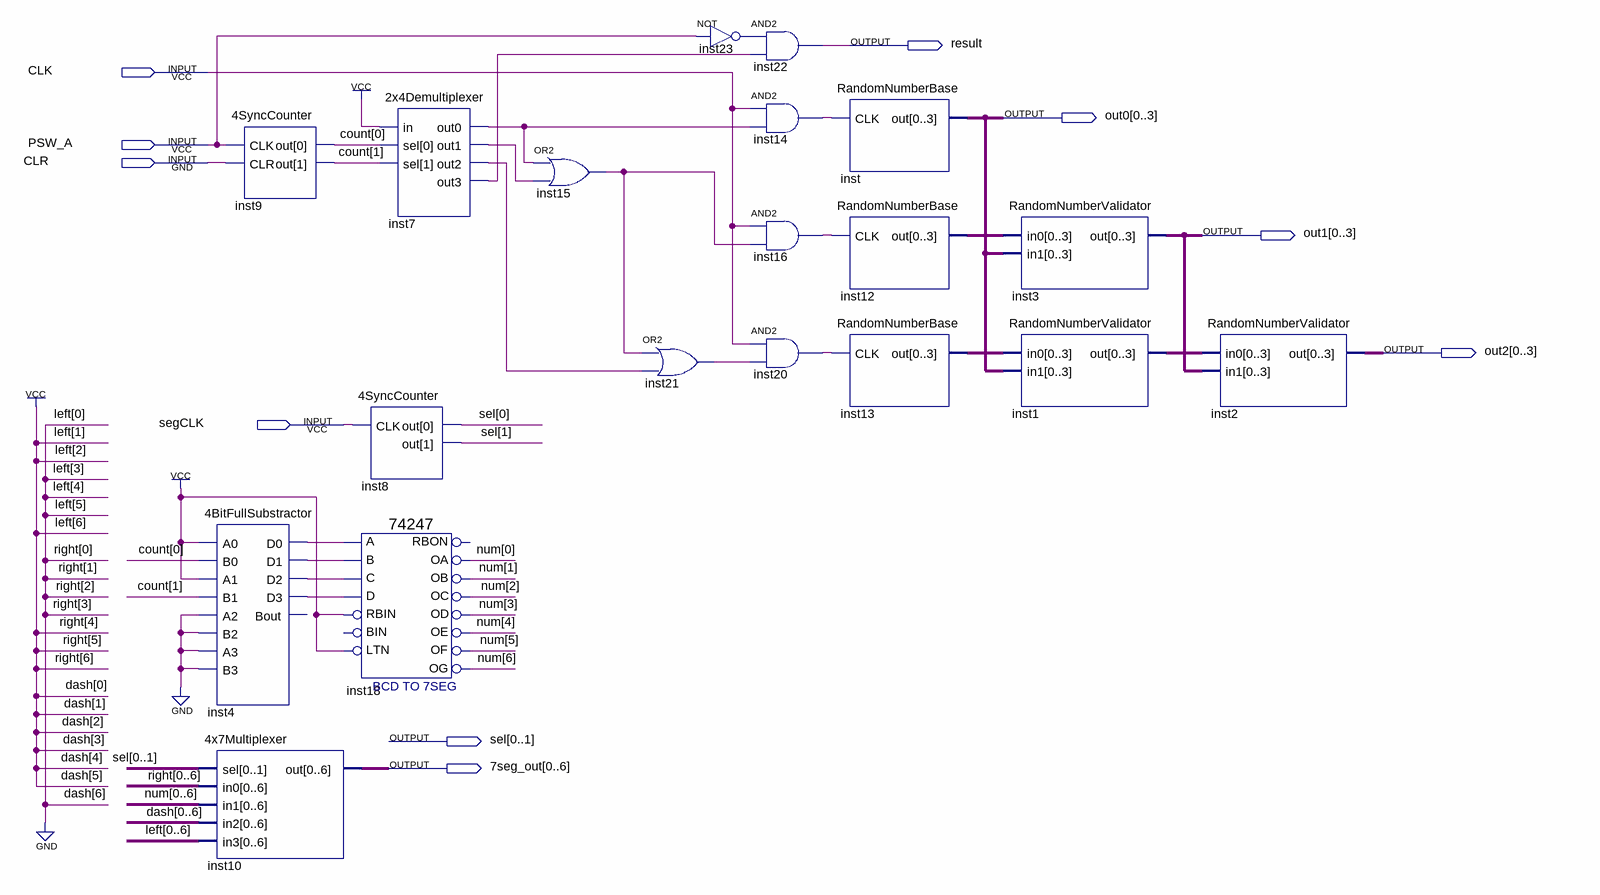
[diagram p0: schematic sheet]
// Quartus schematic RandomNumber.bdf as structural Verilog: 19 symbols, 10 pins
module RandomNumber (
  input  CLK,
  input  PSW_A,
  input  CLR,
  input  segCLK,
  output result,
  output [0:3] out0,
  output [0:3] out1,
  output [0:3] out2,
  output [0:1] sel,
  output [0:6] \7seg_out 
);

  wire inst4_d0, inst4_d1, inst4_d2, inst4_d3, inst7_out0, inst7_out1, inst7_out2, inst7_out3, inst14_out,
       inst15_out, inst16_out, inst20_out, inst21_out, inst23_out;
  wire [1:0] count;
  wire [3:0] inst1_out, inst12_out, inst13_out;
  wire [6:0] num;

  \4SyncCounter  inst9 (.CLK(PSW_A), .CLR(CLR), .out(count));
  \4BitFullSubstractor  inst4 (
    .A0(1'b1), .B0(count[0]), .A1(1'b1), .B1(count[1]), .A2(1'b0), .B2(1'b0), .A3(1'b0), .B3(1'b0),
    .D0(inst4_d0), .D1(inst4_d1), .D2(inst4_d2), .D3(inst4_d3));  // open: Bout
  \4x7Multiplexer  inst10 (
    .sel(sel), .in0(7'b0000111), .in1({num[0], num[1], num[2], num[3], num[4], num[5], num[6]}),
    .in2(7'b1111110), .in3(7'b0110001), .out(\7seg_out ));
  \2x4Demultiplexer  inst7 (
    .in(1'b1), .sel(count), .out0(inst7_out0), .out1(inst7_out1), .out2(inst7_out2), .out3(inst7_out3));
  \4SyncCounter  inst8 (.CLK(segCLK), .out({sel[1], sel[0]}));
  \74247  inst18 (
    .LTN(1'b1), .A(inst4_d0), .B(inst4_d1), .RBIN(1'b1), .C(inst4_d2), .D(inst4_d3), .OF(num[5]),
    .OC(num[2]), .OD(num[3]), .OE(num[4]), .OA(num[0]), .OB(num[1]), .OG(num[6]));  // open: BIN, RBON
  or inst15 (inst15_out, inst7_out0, inst7_out1);
  or inst21 (inst21_out, inst15_out, inst7_out2);
  and inst22 (result, inst23_out, inst7_out3);
  not inst23 (inst23_out, PSW_A);
  and inst14 (inst14_out, CLK, inst7_out0);
  and inst16 (inst16_out, CLK, inst15_out);
  and inst20 (inst20_out, CLK, inst21_out);
  RandomNumberBase inst (.CLK(inst14_out), .out(out0));
  RandomNumberBase inst12 (.CLK(inst16_out), .out(inst12_out));
  RandomNumberBase inst13 (.CLK(inst20_out), .out(inst13_out));
  RandomNumberValidator inst3 (.in0(inst12_out), .in1(out0), .out(out1));
  RandomNumberValidator inst1 (.in0(inst13_out), .in1(out0), .out(inst1_out));
  RandomNumberValidator inst2 (.in0(inst1_out), .in1(out1), .out(out2));
endmodule
